# EAGLE design MinieasySens-RS485_V01-Build009 (EAGLE 7.6.0)
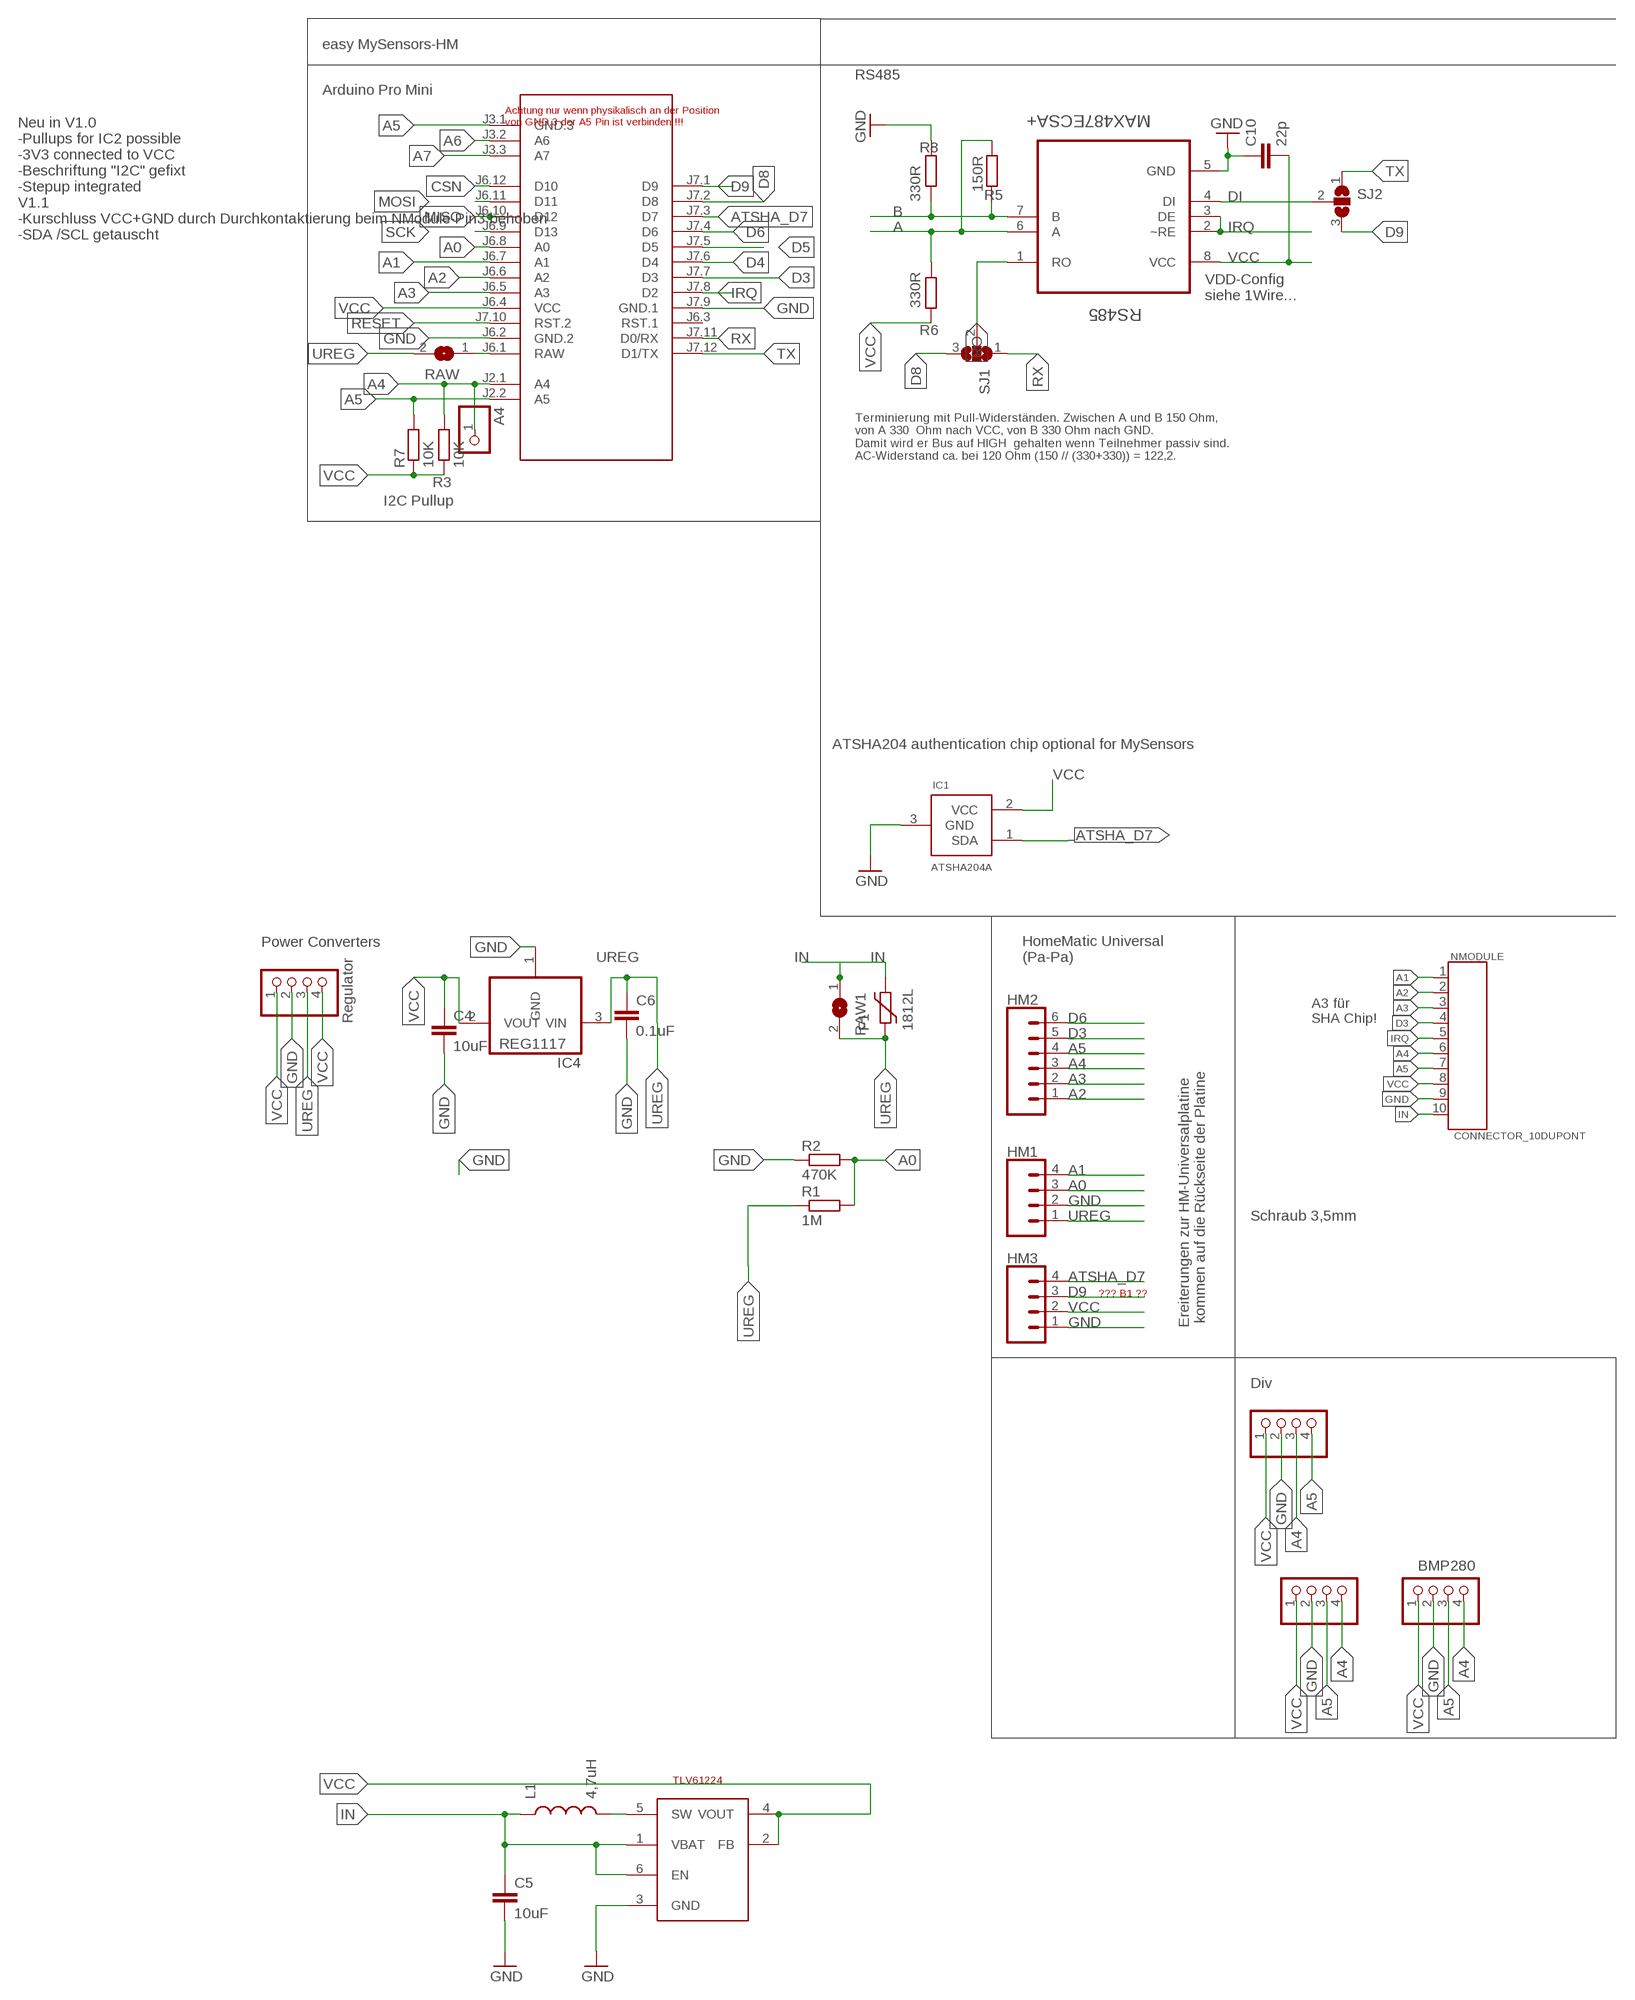
[diagram p0: schematic, sheet 1, part 1 of 2]
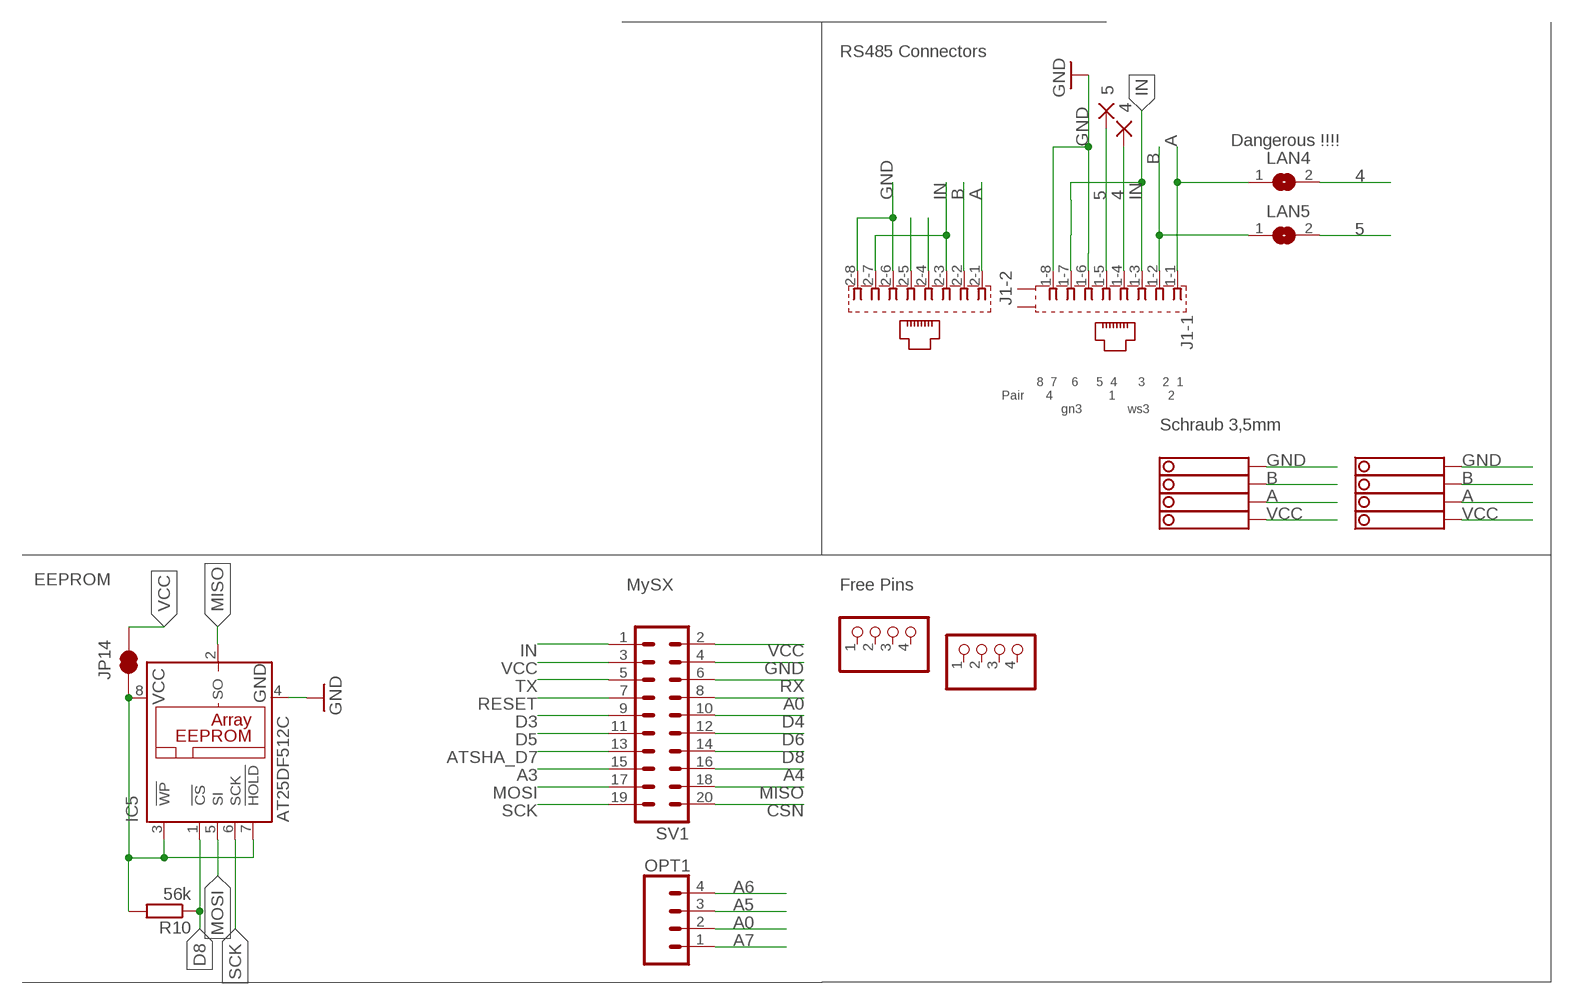
[diagram p1: schematic, sheet 1, part 2 of 2]

## Parts
4  1,6/0,8  [1,6/0,8]
5  1,6/0,8  [1,6/0,8]
A4  PINHD-1X1  [1X01]
BH1750  PINHD-1X04_2.54-S  [1X04-S]
C4  10uF  C-EUC1210  [C1210]
C5  10uF  CAP0805  [0805]
C6  0.1uF  C-EUC1206  [C1206]
C10  22p  C-EUC0805  [C0805]
F1  1812L  [1812L]
HM1  CONN_04  [1X04]
HM2  CONN_06SILK_FEMALE_PTH  [1X06]
HM3  CONN_04  [1X04]
I2C-1  PINHD-1X04_2.54-S  [1X04-S]
I2C-2  PINHD-1X04_2.54-S  [1X04-S]
IC1  ATSHA204A  [SOT23]
IC4  REG1117  [SOT223]
IC5  AT25DF512C  25AA080SN  [SO-08]
J1  557570-1  [557570-1]
JP2  PINHD-1X04_2.54-S  [1X04-S]
JP4  PINHD-1X04_2.54-S  [1X04-S]
JP14  JUMPER-SMT_2_NC_TRACE_SILK  [SMT-JUMPER_2_NC_TRACE_SILK]
L1  4,7uH  INDUCTOR0805  [0805]
LAN4  SJ  [SJ]
LAN5  SJ  [SJ]
M1  ARDUINO-PRO-MINI-3.3V#NP  [ARDUINO-PRO-MINI#NP]
NMODULE  CONNECTOR_10DUPONT  [DUPONT_10]
OPT1  CONN_04  [1X04]
R1  1M  R-EU_R0805  [R0805]
R2  470K  R-EU_R0805  [R0805]
R3  10K  R-EU_R0805  [R0805]
R5  150R  R-EU_R0805  [R0805]
R6  330R  R-EU_R0805  [R0805]
R7  10K  R-EU_R0805  [R0805]
R8  330R  R-EU_R0805  [R0805]
R10  56k  R-EU_M0805  [M0805]
RAW  SJ  [SJ]
RAW1  SJ  [SJ]
RS485  MAX487ECSA+  [SOIC127P600X175-8N]
SJ1  SJ2W  [SJ_2]
SJ2  SJ2W  [SJ_2]
STEPDWN  PINHD-1X04_2.54-S  [1X04-S]
STEPUP  TLV61224  TI-TLV61224  [SOT23-6L]
SV1  MA10-2  [MA10-2]
X1  1751264  [1751264]
X4  1751264  [1751264]

## Nets
4: 4.1(P) J1.1-4 LAN4.2
5: 5.1(P) J1.1-5 LAN5.2
A: J1.1-1 J1.2-1 LAN4.1 R5.1 R6.2 RS485.6(A) X1.2 X4.2
A0: HM1.3 M1.J6.8(A0) OPT1.2 R1.2 R2.2 SV1.8
A1: HM1.4 M1.J6.7(A1) NMODULE.1
A2: HM2.1 M1.J6.6(A2) NMODULE.2
A3: HM2.2 M1.J6.5(A3) NMODULE.3 SV1.15
A4: A4.1 BH1750.4 HM2.3 I2C-1.4 I2C-2.3 M1.J2.1(A4) NMODULE.6 R3.2 SV1.16
A5: BH1750.3 HM2.4 I2C-1.3 I2C-2.4 M1.J2.2(A5) M1.J3.1(GND.3) NMODULE.7 OPT1.3 R7.2
A6: M1.J3.2(A6) OPT1.4
A7: M1.J3.3(A7) OPT1.1
ATSHA_D7: HM3.4 IC1.1(SDA) M1.J7.3(D7) SV1.13
B: J1.1-2 J1.2-2 LAN5.1 R5.2 R8.1 RS485.7(B) X1.3 X4.3
CSN: M1.J6.12(D10) SV1.20
D3: HM2.5 M1.J7.7(D3) NMODULE.4 SV1.9
D4: M1.J7.6(D4) SV1.10
D5: M1.J7.5(D5) SV1.11
D6: HM2.6 M1.J7.4(D6) SV1.12
D8: IC5.1(!CS) M1.J7.2(D8) R10.1 SJ1.3 SV1.14
D9: HM3.3 M1.J7.1(D9) SJ2.3
DI: RS485.4(DI) SJ2.2
GND [Power]: BH1750.2 C4.2 C5.2 C6.2 C10.1 HM1.2 HM3.1 I2C-1.2 I2C-2.2 IC1.3(GND) IC4.1(GND) IC5.4(GND) J1.1-6 J1.1-8 J1.2-6 J1.2-8 M1.J6.2(GND.2) M1.J7.9(GND.1) NMODULE.9 R2.1 R8.2 RS485.5(GND) STEPDWN.2 STEPUP.3(GND) SV1.4 X1.4 X4.4
IN [Power]: C5.1 F1.P$2 J1.1-3 J1.1-7 J1.2-3 J1.2-7 L1.1 NMODULE.10 RAW1.1 STEPUP.1(VBAT) STEPUP.6(EN) SV1.1
IRQ: M1.J7.8(D2) NMODULE.5 RS485.2(~RE) RS485.3(DE)
MISO: IC5.2(SO) M1.J6.10(D12) SV1.18
MOSI: IC5.5(SI) M1.J6.11(D11) SV1.17
N$5: J1.2-4
N$6: J1.2-5
N$13: L1.2 STEPUP.5(SW)
RAW [Power]: M1.J6.1(RAW) RAW.1
RESET: M1.J7.10(RST.2) SV1.7
RO: RS485.1(RO) SJ1.2
RX: M1.J7.11(D0/RX) SJ1.1 SV1.6
SCK: IC5.6(SCK) M1.J6.9(D13) SV1.19
TX: M1.J7.12(D1/TX) SJ2.1 SV1.5
UREG [Power]: C6.1 F1.P$1 HM1.1 IC4.3(VIN) R1.1 RAW1.2 RAW.2 STEPDWN.3
VCC [Power]: BH1750.1 C4.1 C10.2 HM3.2 I2C-1.1 I2C-2.1 IC1.2(VCC) IC4.2(VOUT) JP14.2 M1.J6.4(VCC) NMODULE.8 R3.1 R6.1 R7.1 RS485.8(VCC) STEPDWN.1 STEPDWN.4 STEPUP.2(FB) STEPUP.4(VOUT) SV1.2 SV1.3 X1.1 X4.1
VCC1 [Power]: IC5.3(!WP) IC5.7(!HOLD) IC5.8(VCC) JP14.1 R10.2
Unconnected: J1.G1(-1:S2) J1.G3(-1:S1) JP2.1 JP2.2 JP2.3 JP2.4 JP4.1 JP4.2 JP4.3 JP4.4 M1.J6.3(RST.1)

## Notes on the sheet
- easy MySensors-HM
- RS485
- Arduino Pro Mini
- Achtung nur wenn physikalisch an der Position 
  von GND.3 der A5 Pin ist verbinden !!!
- Neu in V1.0
  -Pullups for IC2 possible
  -3V3 connected to VCC
  -Beschriftung "I2C" gefixt
  -Stepup integrated
  V1.1
  -Kurschluss VCC+GND durch Durchkontaktierung beim NModule-Pin3 behoben
  -SDA /SCL getauscht
- VDD-Config
  siehe 1Wire...
- Terminierung mit Pull-Widerständen. Zwischen A und B 150 Ohm,
  von A 330  Ohm nach VCC, von B 330 Ohm nach GND. 
  Damit wird er Bus auf HIGH  gehalten wenn Teilnehmer passiv sind.
  AC-Widerstand ca. bei 120 Ohm (150 // (330+330)) = 122,2.
- I2C Pullup
- RS485 Connectors
- Dangerous !!!!
- ATSHA204 authentication chip optional for MySensors
- Power Converters
- 8  7    6     5  4      3     2  1
  Pair      4                1               2
                   gn3             ws3
- HomeMatic Universal
  (Pa-Pa)
- Schraub 3,5mm
- Regulator
- A3 für 
  SHA Chip!
- EEPROM
- MySX | Free Pins
- Schraub 3,5mm
- ??? B1 ??
- Ereiterungen zur HM-Universalplatine
   kommen auf die Rückseite der Platine
- Div
- BMP280

## Library data of the parts
4 5 = wirepad:1,6/0,8: THROUGH-HOLE PAD
A4 = pinhead:PINHD-1X1: PIN HEADER
BH1750 I2C-1 I2C-2 JP2 JP4 STEPDWN = pinhead-2:PINHD-1X04: PIN HEADER
C4 C6 C10 = rcl:C-EU: CAPACITOR, European symbol
C5 = SparkFun-Passives:CAP: Capacitor Standard 0603 ceramic capacitor, and 0.1" leaded capacitor.
F1 = ptc-littlefuse:1812L
HM1 HM3 OPT1 = SparkFun-Connectors:CONN_04: Multi connection point. Often used as Generic Header-pin footprint for 0.1 inch spaced/style header connections On any of the 0.1 inch spaced packages, you can populate with these: Break Away Headers - Straight <https://www.sparkfun.com/products/116> (PRT-00116) Break Away Male Headers - Right Angle <https://www.sparkfun.com/products/553> (PRT-00553) Female Headers <https://www.sparkfun.com/products/115> (PRT-00115) Break Away Headers - Machine Pin <https://www.sparkfun.com/products/117> (PRT-00117) Break Away Female Headers - Swiss Machine Pin <https://www.sparkfun.com/products/743> (PRT-00743) For SCREWTERMINALS and SPRING TERMINALS visit here: Screw Terimnals on SparkFun.com <https://www.sparkfun.com/search/results?term=Screw+Terminals> (5mm/3.5mm/2.54mm spacing) This device is also useful as a general connection point to wire up your design to another part of your project. Our various solder wires solder well into these plated through hole pads. Hook-Up Wire - Assortment (Stranded, 22 AWG) <https://www.sparkfun.com/products/11375> (PRT-11375) Hook-Up Wire - Assortment (Solid Core, 22 AWG) <https://www.sparkfun.com/products/11367> (PRT-11367) View the entire wire category on our website here <https://www.sparkfun.com/categories/141> Special notes: Molex polarized connector foot print use with SKU : PRT-08231 with associated crimp pins and housings. 1MM SMD Version SKU: PRT-10208; PROD_ID: CONN-09696
HM2 = SparkFun-Connectors:CONN_06: Multi connection point. Often used as Generic Header-pin footprint for 0.1 inch spaced/style header connections On any of the 0.1 inch spaced packages, you can populate with these: Break Away Headers - Straight <https://www.sparkfun.com/products/116> (PRT-00116) Break Away Male Headers - Right Angle <https://www.sparkfun.com/products/553> (PRT-00553) Female Headers <https://www.sparkfun.com/products/115> (PRT-00115) Break Away Headers - Machine Pin <https://www.sparkfun.com/products/117> (PRT-00117) Break Away Female Headers - Swiss Machine Pin <https://www.sparkfun.com/products/743> (PRT-00743) Arduino Stackable Header - 6 Pin <https://www.sparkfun.com/products/9280> (PRT-09280) For SCREWTERMINALS and SPRING TERMINALS visit here: Screw Terimnals on SparkFun.com <https://www.sparkfun.com/search/results?term=Screw+Terminals> (5mm/3.5mm/2.54mm spacing) This device is also useful as a general connection point to wire up your design to another part of your project. Our various solder wires solder well into these plated through hole pads. Hook-Up Wire - Assortment (Stranded, 22 AWG) <https://www.sparkfun.com/products/11375> (PRT-11375) Hook-Up Wire - Assortment (Solid Core, 22 AWG) <https://www.sparkfun.com/products/11367> (PRT-11367) View the entire wire category on our website here <https://www.sparkfun.com/categories/141>; PROD_ID: CONN-08437
IC1 = Sensor:ATSHA204A
IC4 = burr-brown:REG1117: 800mA and 1A Low Dropout (LDO) Positive Regulator 1.8V, 2.5V, 2.85V, 3.3V, 5V, and Adj; MPN: REG1117; OC_FARNELL: 1097566; OC_NEWARK: 14P6981
IC5 = microchip:25*: Serial EEPROM 4K/ 8K , SPI bus; MF: MICROCHIP; MPN: 25AA080/SN; OC_FARNELL: 1816072; OC_NEWARK: 92C7351
J1 = con-amp:557570-1: AMP connector
JP14 = SparkFun-Jumpers:JUMPER-SMT_2_NC_TRACE: Normally closed trace jumper This jumper has a trace between two pads so it's normally closed (NC). Use a razor knife to open the connection. For best results follow the IPC guidelines for cutting traces: Cutout at least 0.063 mm (0.005 in). Remove all loose material to clean up the cut area. Seal the cut with an approved epoxy. Reapply solder to reclose the connection.
L1 = SparkFun-Passives:INDUCTOR: Inductors Basic Inductor/Choke - 0603 and 1206. Footprints are not proven and vary greatly between part numbers.
LAN4 LAN5 RAW RAW1 = jumper:SJ: SMD solder JUMPER
M1 = diy-modules:ARDUINO-PRO-MINI-*#NP: Arduino Pro Mini without programming pads
NMODULE = TD-MySensors:CONNECTOR_10
R1-R3 R5-R8 = rcl:R-EU_: RESISTOR, European symbol
R10 = resistor:R-EU_: RESISTOR, European symbol
RS485 = Maxim_By_element14_Batch_1:MAX487ECSA+: Low-Power, Slew-Rate-Limited RS-485/RS-422 Transceivers; MPN: MAX487ECSA+; OC_FARNELL: 9724532; OC_NEWARK: 68K4803; PACKAGE: SOIC-8; SUPPLIER: Maxim
SJ1 SJ2 = jumper:SJ2W: SMD solder JUMPER
STEPUP = TLV61224:TI-TLV61224
SV1 = con-lstb:MA10-2: PIN HEADER; OC_FARNELL: unknown; OC_NEWARK: unknown
X1 X4 = con-phoenix-350:1751264: MKDS 1/ 4-3,5 Printklemme Nennstrom: 10 A Bemessungsspannung: 160 V Raster: 3,5 mm Polzahl: 4 Montageart: Löten Anschlussart: Schraubanschluss Anschlussrichtung vom Leiter zur Platine: 0° Source: http://eshop.phoenixcontact.com .. 1751264.pdf; MPN: 1751264; OC_FARNELL: unknown; OC_NEWARK: 10R0934

## Net classes
0 default: width 0.305 mm
1 Power: width 0.508 mm

## Board
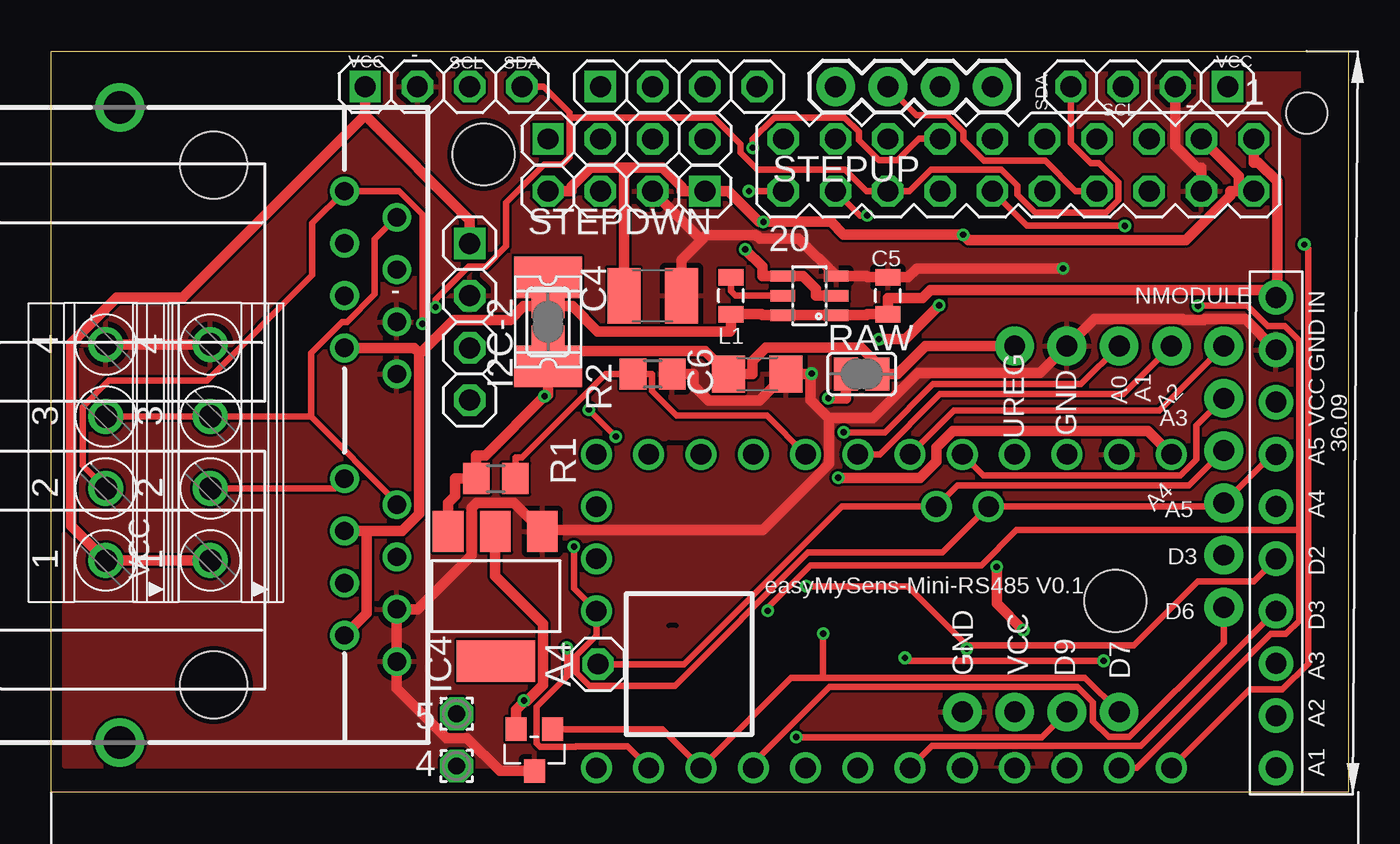
[diagram p2: board, top side]
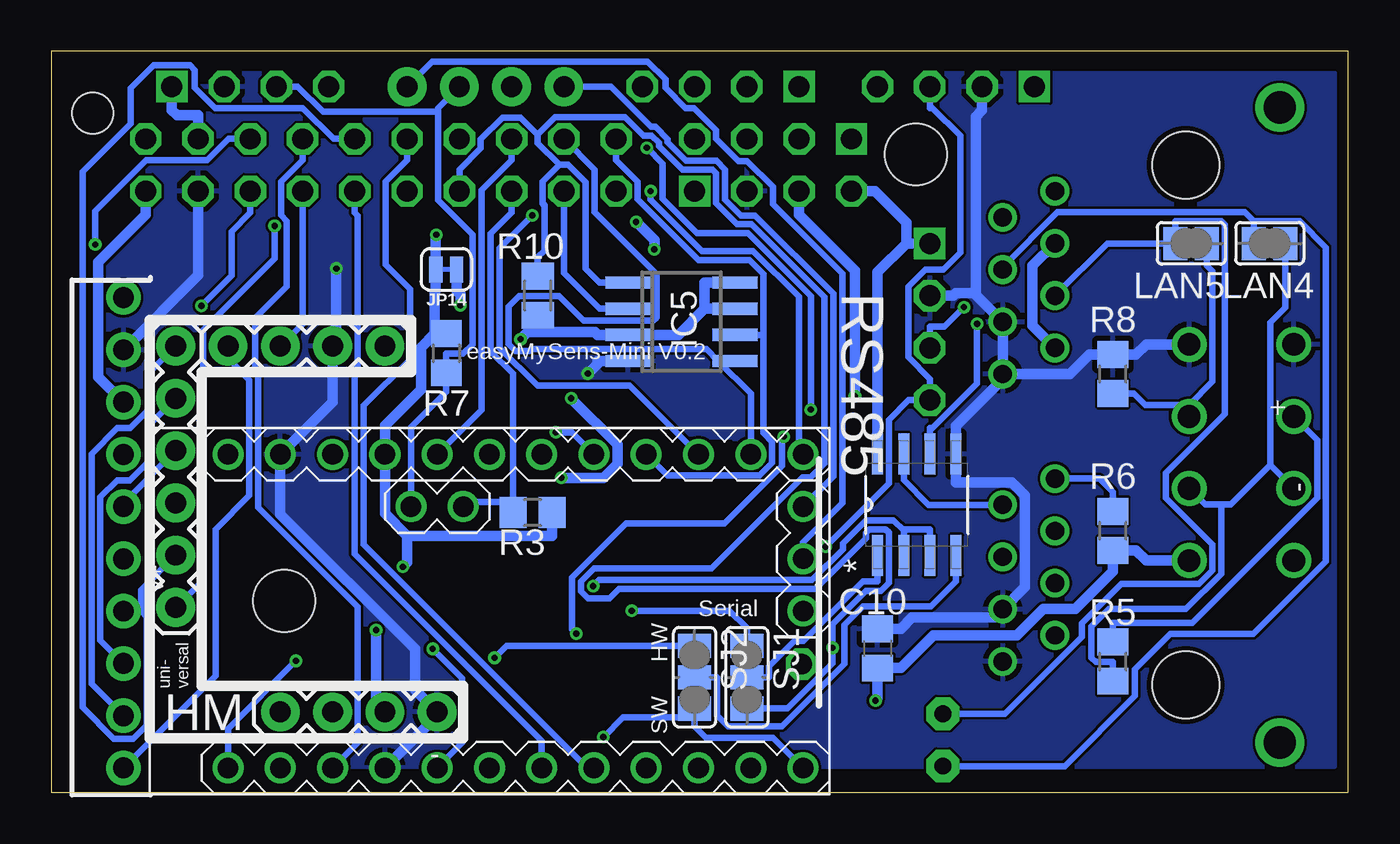
[diagram p3: board, bottom side, seen from below]

Size 63 x 36 mm. Coordinates in mm from the lower left corner, seen from the top.
Outline: 63,0 0,0 0,36 63,36 63,0
Copper layers (1*16): Top 0.035mm / dielectric 1.5mm / Bottom 0.035mm
Design rules "dirt_cheap_dirty_boards.v1": minimum track width 5mil, minimum drill 12mil, track to track 5mil, track to pad 5mil, pad to pad 5mil, via to via 5mil, smd to smd 0mil, copper to edge 10mil, drill to drill 10mil, minimum pad ring 10mil, minimum via ring 6mil, stop-mask expansion 2mil, vias tented up to drill 25mil, thermal gap 10mil
Holes 3 mm at 21,31 51.7,9.3
Holes 2 mm at 61,33
tRestrict: area 61,0 to 61,35.6; area 12.7,0 to 63.2,36.8; 2 lines
bRestrict: area 12.7,0 to 63,36.8; 2 lines

### Footprints (pad centres in the part's own frame; a part is rotated, then mirrored left to right if it is on the bottom)
1,6/0,8 = drill 0.813 pad 1.6 octagon: 1 0,0
1X01 = drill 1.016 octagon: 1 0,0
1X04-S = drill 1.016 square: 1 -3.81,0 | drill 1.016 octagon: 2 -1.27,0; 3 1.27,0; 4 3.81,0
C1210 = smd 1.6 x 2.7: 1 -1.4,0; 2 1.4,0
0805 = smd 0.8 x 1.2: 1 -0.9,0; 2 0.9,0
C1206 = smd 1.6 x 1.8: 1 -1.4,0; 2 1.4,0
C0805 = smd 1.3 x 1.5: 1 -0.95,0; 2 0.95,0
1812L = smd 2.03 x 3.3: P$1 -2.16,0; P$2 2.16,0
1X04 = drill 1.016 pad 1.88: 1 0,0; 2 2.54,0; 3 5.08,0; 4 7.62,0
1X06 = drill 1.016 pad 1.88: 1 0,0; 2 2.54,0; 3 5.08,0; 4 7.62,0; 5 10.16,0; 6 12.7,0
SOT23 = smd 1.016 x 1.143: 1 -0.889,-1.016; 2 0.889,-1.016; 3 0,1.016
SOT223 = smd 1.499 x 2.007: 1 -2.261,-3.15; 2 0.025,-3.15; 3 2.311,-3.15 | smd 3.81 x 2.007: 4 0,3.15
SO-08 = smd 0.6 x 2.2: 1 -1.905,-2.6; 2 -0.635,-2.6; 3 0.635,-2.6; 4 1.905,-2.6; 5 1.905,2.6; 6 0.635,2.6; 7 -0.635,2.6; 8 -1.905,2.6
557570-1 = drill 0.889: 1-1 -11.43,6.35; 1-2 -10.16,8.89; 1-3 -8.89,6.35; 1-4 -7.62,8.89; 1-5 -6.35,6.35; 1-6 -5.08,8.89; 1-7 -3.81,6.35; 1-8 -2.54,8.89; 2-1 2.54,6.35; 2-2 3.81,8.89; 2-3 5.08,6.35; 2-4 6.35,8.89; 2-5 7.62,6.35; 2-6 8.89,8.89; 2-7 10.16,6.35; 2-8 11.43,8.89 | drill 1.575 pad 2.184: G1 -15.494,-4.572; G3 15.367,-4.572 | hole 3.251: -12.7,0; 12.573,0
SMT-JUMPER_2_NC_TRACE_SILK = smd 0.635 x 1.27: 1 -0.508,0; 2 0.508,0
SJ = smd 1.168 x 1.6: 1 -0.762,0; 2 0.762,0
ARDUINO-PRO-MINI#NP = drill 1: J2.1 -1.27,5.08; J2.2 -3.81,5.08; J3.1 15.24,0; J3.2 15.24,2.54; J3.3 15.24,5.08; J6.1 -12.7,7.62; J6.2 -10.16,7.62; J6.3 -7.62,7.62; J6.4 -5.08,7.62; J6.5 -2.54,7.62; J6.6 0,7.62; J6.7 2.54,7.62; J6.8 5.08,7.62; J6.9 7.62,7.62; J6.10 10.16,7.62; J6.11 12.7,7.62; J6.12 15.24,7.62; J7.1 15.24,-7.62; J7.2 12.7,-7.62; J7.3 10.16,-7.62; J7.4 7.62,-7.62; J7.5 5.08,-7.62; J7.6 2.54,-7.62; J7.7 0,-7.62; J7.8 -2.54,-7.62; J7.9 -5.08,-7.62; J7.10 -7.62,-7.62; J7.11 -10.16,-7.62; J7.12 -12.7,-7.62
DUPONT_10 = drill 1.016 pad 1.676: 1 1.27,1.27; 2 3.81,1.27; 3 6.35,1.27; 4 8.89,1.27; 5 11.43,1.27; 6 13.97,1.27; 7 16.51,1.27; 8 19.05,1.27; 9 21.59,1.27; 10 24.13,1.27
R0805 = smd 1.3 x 1.5: 1 -0.95,0; 2 0.95,0
M0805 = smd 1.3 x 1.6: 1 -0.95,0; 2 0.95,0
SOIC127P600X175-8N = smd 1.981 x 0.533: 1 -2.464,1.905; 2 -2.464,0.635; 3 -2.464,-0.635; 4 -2.464,-1.905; 5 2.464,-1.905; 6 2.464,-0.635; 7 2.464,0.635; 8 2.464,1.905
SJ_2 = smd 1.168 x 1.6: 1 -1.524,0; 2 0,0; 3 1.524,0
SOT23-6L = smd 0.55 x 1.2: 1 -0.95,-1.3; 2 0,-1.3; 3 0.95,-1.3; 4 0.95,1.3; 5 0,1.3; 6 -0.95,1.3
MA10-2 = drill 1.016 octagon: 1 -11.43,-1.27; 2 -11.43,1.27; 3 -8.89,-1.27; 4 -8.89,1.27; 5 -6.35,-1.27; 6 -6.35,1.27; 7 -3.81,-1.27; 8 -3.81,1.27; 9 -1.27,-1.27; 10 -1.27,1.27; 11 1.27,-1.27; 12 1.27,1.27; 13 3.81,-1.27; 14 3.81,1.27; 15 6.35,-1.27; 16 6.35,1.27; 17 8.89,-1.27; 18 8.89,1.27; 19 11.43,-1.27; 20 11.43,1.27
1751264 = drill 1.1 pad 1.7: 1 -5.25,-0.1; 2 -1.75,-0.1; 3 1.75,-0.1; 4 5.25,-0.1

### Placement (x,y rotation side)
4  19.68,1.27 0 top
5  19.68,3.81 0 top
A4  26.56,6.22 90 top
BH1750  19.05,34.29 0 top
C4  29.21,24.13 0 top
C5  40.64,24.13 90 top
C6  34.29,20.32 0 top
C10  22.86,6.99 270 bottom
F1  24.13,22.86 90 top
HM1  46.8,21.68 180 bottom
HM2  56.96,21.68 270 bottom
HM3  44.26,3.9 180 bottom
I2C-1  53.34,34.29 180 top
I2C-2  20.32,22.86 270 top
IC1  23.46,2.04 180 top
IC4  21.59,9.53 180 top
IC5  32.38,22.86 270 bottom
J1  7.89,17.78 270 top
JP2  30.48,34.29 0 top
JP4  27.94,31.75 0 top
JP14  43.81,25.4 180 bottom
L1  33.02,24.13 90 top
LAN4  3.81,26.67 180 bottom
LAN5  7.62,26.67 180 bottom
M1  41.72,8.8 0 bottom
NMODULE  60.77,-0.09 90 top
OPT1  38.1,34.29 0 top
R1  21.59,15.24 0 top
R2  29.21,20.32 180 top
R3  39.62,13.59 180 bottom
R5  11.43,6.35 90 bottom
R6  11.43,12.7 90 bottom
R7  43.81,21.34 270 bottom
R8  11.43,20.32 90 bottom
R10  39.37,24.13 270 bottom
RAW  39.37,20.32 0 top
RAW1  24.13,22.86 270 top
RS485  20.95,13.97 90 bottom
SJ1  29.21,5.59 270 bottom
SJ2  31.75,5.59 270 bottom
STEPDWN  27.94,29.21 180 top
STEPUP  36.83,24.13 90 top
SV1  46.99,30.48 180 top
X1  2.54,16.51 90 top
X4  7.62,16.51 90 top

### Tracks (layer width: path | path; a pad name or v marks a point on that pad's centre or on a via)
4
  Bottom 0.305: 4.57,27.75 2.35,27.75 1.07,26.48 1.07,11.23 4.62,7.68 8.64,7.68 10.36,5.97 10.36,4.67 13.76,1.27 4.1 | 4.57,27.75 4.57,27.64 LAN4.2 | 4.57,27.75 5,28.18 14.12,28.18 16.78,25.52 J1.1-4
5
  Bottom 0.305: 5.1 16.67,3.81 12.93,7.55 12.93,8.21 11.01,10.13 7.25,10.13 6.59,10.79 6.59,12.03 8.85,14.29 8.85,15.53 5.99,18.38 5.99,27.59 6.15,27.75 8.38,27.75 LAN5.2 11.7,26.67 J1.1-5
A  (via drill 0.3 pad 0.61)
  Top 0.305: v18.03,22.77 18.03,28.08 16.89,29.21 J1.1-1 12.68,27.65 12.68,25.12 7.57,20.01 2.79,20.01 1.51,18.73 1.51,15.89 X1.2 | X4.2 13.76,14.76 J1.2-1
  Bottom 0.305: RS485.6 20.32,17.7 20.19,17.7 18.03,19.87 v18.03,22.77 | R6.2 11.43,14.58 12.09,15.24 J1.2-1 | 6.16,13.98 5.68,13.98 3.77,15.89 | X4.2 6.94,13.98 6.16,13.98 | 6.16,13.98 6.16,10.61 7.87,8.9 11.63,8.9 12.46,8.06 12.46,6.54 12.26,6.33 11.43,6.33 R5.1 | 3.77,15.89 3.77,22.83 3.05,23.55 LAN4.1 | X1.2 3.77,15.89
A0  (via drill 0.3 pad 0.61)
  Top 0.305: SV1.8 49.76,29.21 48.28,30.68 45.31,30.68 44.31,31.69 44.31,32.09 43.51,32.9 42.03,32.9 OPT1.2 | HM1.3 50.03,19.83 42.83,19.83 40.49,17.49 v38.49,17.49 | M1.J6.8 34.76,18.3 30.38,18.3 29.19,19.49 29.19,20.32 R2.2 27.33,20.32 26.91,20.32 22.86,16.27 22.54,16.27 R1.2
  Bottom 0.305: HM1.3 50.8,22.76 50.8,28.17 SV1.8 | M1.J6.8 37.71,17.49 v38.49,17.49
A1
  Top 0.305: HM1.4 52.08,19.34 43.18,19.34 40.26,16.42 M1.J6.7
  Bottom 0.305: NMODULE.1 55.02,5.66 55.02,12.77 53.39,14.41 53.39,20.04 54.42,21.07 HM1.4
A2
  Top 0.305: HM2.1 53.83,18.55 43.85,18.55 M1.J6.6
  Bottom 0.305: HM2.1 58.28,20.36 58.28,18.59 59.18,17.69 59.81,17.69 61.05,16.45 61.05,5.27 NMODULE.2
A3
  Top 0.305: M1.J6.5 45.29,15.39 54.85,15.39 55.63,16.16 55.63,17.81 HM2.2
  Bottom 0.305: HM2.2 58.22,17.88 58.22,16.12 59.19,15.15 59.81,15.15 60.62,14.34 60.62,7.38 NMODULE.3 | SV1.15 40.64,30.71 42.1,29.25 42.1,18.58 M1.J6.5
A4  (via drill 0.3 pad 0.61)
  Top 0.305: HM2.3 55.27,14.91 44.02,14.91 M1.J2.1 38.4,13.88 30.74,6.22 27.6,6.22 A4.1 | I2C-1.4 49.53,31.54 50.49,30.58 50.9,30.58 51.84,29.64 51.84,28.78 51.23,28.17 47.82,28.17 46.94,29.05 46.94,29.47 46.15,30.25 42.72,30.25 41.68,29.21 SV1.16 40.6,29.21 40.56,29.21 40.12,29.21 39.6,29.21 38.56,30.25 34.32,30.25 33.49,31.08 33.49,31.49 32.19,32.79 25.17,32.79 | 25.17,32.79 25.17,33.02 23.9,34.29 BH1750.4 | v18.66,23.57 18.66,23.95 20.27,25.55 21.12,25.55 22.1,26.53 22.1,28.65 23.95,30.5 24.8,30.5 25.17,30.87 25.17,32.79
  Bottom 0.305: HM2.3 59.5,14.06 NMODULE.6 | 40.57,14.1 42.77,14.1 M1.J2.1 | I2C-2.3 20.32,22.63 19.6,22.63 v18.66,23.57 | 40.57,14.1 40.57,14.62 40.57,20.34 41.66,21.42 41.66,27.15 40.64,28.17 SV1.16 | R3.2 40.57,14.1
A5  (via drill 0.3 pad 0.61)
  Top 0.305: v25.39,11.93 25.39,9.89 M1.J3.1 26.48,7.62 25.51,6.64 25.51,5.8 26.14,5.17 30.3,5.17 36.77,11.64 43.29,11.64 M1.J2.2 56.78,13.88 HM2.4 59.32,16.42 NMODULE.7
  Bottom 0.305: 44.22,33.07 44.22,28.78 42.55,27.1 42.55,21.76 42.99,21.32 43.81,21.32 R7.2 43.81,19.92 43.81,19.46 45.53,17.74 M1.J2.2 | OPT1.3 44.22,33.25 44.22,33.07 | 44.22,33.07 49.81,33.07 51.03,34.29 I2C-1.3 | v25.39,11.93 22.31,15 22.31,18.1 21.36,19.05 I2C-2.4 20.32,20.09 21.36,21.14 21.36,24.57 20.53,25.4 19.66,25.4 18.84,26.23 18.84,31.89 20.19,33.25 20.32,33.25 BH1750.3
A6
  Bottom 0.305: M1.J3.2 26.48,12.14 24.57,14.05 24.57,25.21 27.94,28.58 27.94,29.42 29.2,30.68 29.61,30.68 30.71,31.77 30.71,32.18 31.77,33.25 32.18,33.25 33.17,34.24 33.17,34.65 34.04,35.51 44.5,35.51 OPT1.4
A7
  Bottom 0.305: M1.J3.3 25.01,15.35 25.01,24.23 28.81,28.03 29.5,28.03 30.28,28.8 30.28,30.27 30.69,30.68 32.16,30.68 33.06,31.58 33.06,31.74 33.65,32.34 33.86,32.34 35.81,34.29 OPT1.1
ATSHA_D7  (via drill 0.3 pad 0.61)
  Top 0.305: v37.49,7.7 37.49,5.56 | 37.49,5.56 35.94,5.56 M1.J7.3 29.68,3.06 25.14,3.06 IC1.1 | HM3.4 50.22,5.56 37.49,5.56 | v26.1,18.6 v27.41,17.29 | SV1.13 42.14,31.75 41.1,30.71 40.2,30.71 39.23,31.68 39.23,32.1 38.54,32.79 35.13,32.79 34.07,31.74 v34.07,31.32
  Bottom 0.305: v27.41,17.29 27.51,17.19 27.51,15.85 30.3,13.06 35.08,13.06 37.71,10.43 37.71,7.92 v37.49,7.7 | v34.07,31.32 33.3,30.55 33.3,28.84 31.63,27.17 29.17,27.17 26.1,24.1 v26.1,18.6
B
  Top 0.305: 12.61,18.26 16.78,14.09 J1.2-2 | 12.61,18.26 X4.3 X1.3 | 12.61,18.26 12.61,21.34 14.13,22.86 14.36,22.86 15.71,24.21 15.71,26.87 J1.1-2
  Bottom 0.305: X1.3 1.51,17.13 1.51,14.29 7.57,8.23 11.43,8.23 R5.2 | 7.72,18.83 9.86,18.83 10.4,19.37 R8.1 | 7.72,18.83 6.59,19.96 6.59,25.32 6.86,25.59 LAN5.1 | X4.3 7.72,18.83 | RS485.7 21.59,15.16 20.4,13.97 J1.2-2
CSN  (via drill 0.3 pad 0.61)
  Top 0.305: SV1.20 v33.89,29.21
  Bottom 0.305: M1.J6.12 26.69,16.63 26.69,24.08 28.91,26.3 31.39,26.3 33.89,28.81 v33.89,29.21
D3
  Top 0.305: NMODULE.4 52.94,2.24 42.78,2.24 M1.J7.7
  Bottom 0.305: 58.65,8.8 58.38,8.53 58.38,3.26 59.03,2.6 59.97,2.6 61.49,4.12 61.49,30.16 59.16,32.48 59.16,34.2 58.03,35.33 56.27,35.33 56.03,35.09 56.03,34.24 55.04,33.25 50.8,33.25 49.3,31.75 SV1.9 | HM2.5 58.65,9.83 58.65,8.8 | NMODULE.4 58.65,8.8
D4
  Bottom 0.305: M1.J7.6 39.18,2.5 48.27,11.59 48.27,20.46 48.12,20.61 48.12,28.02 48.26,28.17 SV1.10
D5
  Bottom 0.305: SV1.11 45.72,30.71 46.76,29.67 46.76,25.63 45.58,24.45 45.58,21.04 47.83,18.78 47.83,12.03 36.98,1.18 M1.J7.5
D6  (via drill 0.3 pad 0.61)
  Top 0.305: SV1.12 47.41,27.52 v52.15,27.52 | HM2.6 56.96,7.25 52.39,2.68 51.37,2.68 50.61,3.44 50.61,4.36 49.84,5.12 37.8,5.12 34.1,1.42 M1.J7.4
  Bottom 0.305: v52.15,27.52 52.15,25.93 55.64,22.45 55.64,10.3 | 55.64,10.3 | 55.64,10.3 HM2.6
D8  (via drill 0.3 pad 0.61)
  Top 0.305: v25.05,7.01 25.05,5.62 23.57,4.14 23.57,2.37 23.73,2.21 25.47,2.21 25.48,2.22 27.98,2.22 M1.J7.2
  Bottom 0.305: 39.37,31.96 38.53,32.8 35.13,32.8 34.24,31.9 33.83,31.9 33.49,31.56 33.49,31.4 32.34,30.25 30.87,30.25 30.71,30.09 30.71,28.62 29.69,27.6 28.99,27.6 25.45,24.05 25.45,15.98 26.13,15.3 26.52,15.3 30.94,10.88 36.64,10.88 37.27,10.25 37.27,9.77 36.93,9.43 35.88,9.43 35.43,9.87 25.87,9.87 23.42,12.32 23.42,12.6 23.24,12.78 22.48,12.78 22.31,12.61 22.31,10.17 22.7,9.78 23.43,9.78 25.05,8.16 v25.05,7.01 25.05,6.26 27.24,4.06 SJ1.3 | 38.32,30.49 37.91,30.49 37.06,29.64 37.06,25.46 36.36,24.77 IC5.1 | 39.37,31.96 39.37,31.54 38.32,30.49 | 38.32,30.49 39.15,29.67 39.15,28.62 39.05,28.52 39.05,26.33 39.37,26.01 R10.1 | 39.37,31.96 40.2,32.79 41.07,32.79 42.14,31.73 42.14,31.29 43.18,30.25 SV1.14
D9  (via drill 0.3 pad 0.61)
  Top 0.305: v36.18,2.68 48.12,2.68 HM3.3
  Bottom 0.305: 31.75,3.63 35.23,3.63 v36.18,2.68 | 31.75,3.63 31.75,3.2 31.19,2.64 27.94,2.64 M1.J7.1 | SJ2.3 31.75,3.63
DI
  Bottom 0.305: RS485.4 19.05,10.24 20.27,9.02 23.57,9.02 24.46,8.13 24.46,6.23 27.49,3.2 30.13,3.2 30.67,3.74 30.67,5.59 SJ2.2
GND  (via drill 0.3 pad 0.61)
  Top 0.508: NMODULE.9 58,23 56.04,23 55.99,22.95 55.02,22.95 54.97,23 50.66,23 HM1.2 48.02,20.36 42.1,20.36 39.92,18.19 37.85,18.19 37.79,18.13 | SV1.4 55.88,30.35 55.66,30.35 54.61,31.4 I2C-1.2 | v49.16,25.45 42.04,25.45 41.62,25.03 C5.2 39.66,25.03 39.61,25.08 STEPUP.3 36.3,26.91 34.43,26.91 34.31,27.03 34.25,27.03 34.22,27.07 31.82,27.07 31.58,26.84 | R2.1 31.19,20.32 31.19,19.77 31.92,19.04 34.41,19.04 C6.2 36.87,20.32 | 37.79,18.13 37.79,18.12 37.79,18.07 37.78,18.06 37.78,15.95 34.57,12.74 23.92,12.74 IC4.1 | 37.79,18.13 36.87,19.05 36.87,20.32 | v36.93,20.35 36.9,20.35 36.87,20.32 | IC4.1 | IC4.1 22.48,14.06 20.66,14.06 20.41,13.81 20.41,11.51 17.79,8.89 J1.2-6 J1.2-8 16.78,5.04 19.2,2.63 20.2,2.63 21.8,1.03 IC1.3 | 31.58,26.84 30.61,25.86 C4.2 | STEPDWN.2 31.58,26.84 | X4.4 X1.4
  Bottom 0.508: v49.16,25.45 49.16,21.86 HM1.2 49.34,18.96 M1.J6.2 51.88,13.51 45.34,6.97 45.34,4.98 HM3.1 44.26,3.72 M1.J7.9 | IC5.4 36.47,20.95 36.47,20.82 v36.93,20.35 | C10.1 21.73,7.93 21.18,8.48 17.18,8.48 J1.2-6 15.7,9.97 15.7,14.42 16.34,15.06 19.05,15.06 RS485.5 19.05,17.8 16.78,20.07 J1.1-8 | 18.09,24.26 18.09,32.84 17.78,33.15 BH1750.2 | 18.09,24.26 18.09,24.17 J1.1-6 J1.1-8 | 18.09,24.26 19.05,24.26 19.18,24.13 I2C-2.2 | X4.4 9.81,21.76 10.3,21.27 R8.2 12.56,21.27 13.51,20.32 J1.1-8 | SV1.4 55.88,25.12 NMODULE.9
  pour Bottom: 0.64,34.92 60.96,34.92 60.96,1.27 0.64,1.27
  pour Top: 0.64,34.92 60.96,34.92 60.96,1.27 0.64,1.27
IN
  Top 0.508: 17.86,21.36 17.95,21.36 19.55,22.95 22.28,22.95 22.95,23.62 RAW1.1 | J1.1-7 17.63,21.59 17.86,21.36 | 17.86,21.36 17.86,13.53 17.04,12.7 15.32,12.7 | 59.15,24.39 59.56,24.81 59.56,29.69 58.64,30.61 58.42,30.61 SV1.1 | 59.15,24.39 42.7,24.39 42.32,24.01 40.64,24.01 C5.1 39.66,23.23 39.61,23.18 STEPUP.1 STEPUP.6 34.55,23.18 34.5,23.23 33.51,23.23 33.27,23.23 L1.1 33.02,22.45 32.97,22.4 26.54,22.4 25.31,23.62 RAW1.1 | NMODULE.10 59.15,24.39 | RAW1.1 F1.P$2 | 15.32,12.7 J1.2-3 | 15.32,12.7 15.32,8.7 J1.2-7
  Bottom 0.508: J1.1-7 15.33,22.68 15.33,25.58 J1.1-3
IRQ  (via drill 0.3 pad 0.61)
  Top 0.305: 44.48,7.14 v44.48,6.97 | v36.68,10.01 41.61,10.01 44.48,7.14 | NMODULE.5 58.41,10.25 55.71,10.25 52.6,7.14 44.48,7.14
  Bottom 0.305: M1.J7.8 43.04,2.4 43.04,5.53 v44.48,6.97 | 21.59,12.72 22.08,13.21 23.42,13.21 24.55,12.09 24.55,11.8 26.05,10.31 36.39,10.31 v36.68,10.01 | 21.59,12.72 21.54,12.78 20.32,12.78 RS485.3 | 21.59,12.72 21.59,12.67 RS485.2
MISO  (via drill 0.3 pad 0.61)
  Top 0.305: SV1.18 39.28,28.03 v39.64,28.03
  Bottom 0.305: v39.64,28.03 41.22,26.45 41.22,21.6 39.39,19.76 34.9,19.76 M1.J6.10 | IC5.2 35.57,23.5 36.36,23.5 38.1,25.23 38.1,28.17 SV1.18
MOSI
  Bottom 0.305: 30.6,20.95 31.18,21.53 39.69,21.53 39.79,21.43 40.45,21.43 40.79,21.78 40.79,23.61 40.29,24.11 38.34,24.11 37.15,22.92 33.77,22.92 33.61,23.08 33.61,25.18 36.6,28.18 36.6,30.25 SV1.17 | M1.J6.11 29.02,19.37 30.6,20.95 | IC5.5 30.6,20.95
N$13
  Top 0.305: L1.2 33.02,24.35 33.24,24.13 STEPUP.5
RAW  (via drill 0.3 pad 0.61)
  Top 0.508: v37.75,19.14 38.61,19.14 RAW.1 | M1.J6.1 53.28,17.56 43.79,17.56 42.99,16.76 42.99,16.08 42.19,15.28 v38.23,15.28
  Bottom 0.508: v38.23,15.28 36.17,15.28 35.5,15.95 35.5,16.89 v37.75,19.14
RESET
  Bottom 0.305: M1.J7.10 48.12,2.4 48.12,8.99 52.95,13.83 52.95,20.46 53.1,20.61 53.1,23.05 51.57,24.58 51.57,27.77 51.84,28.04 51.84,29.67 50.8,30.71 SV1.7
RO
  Bottom 0.305: RS485.1 22.86,10.24 23.58,10.24 26.45,7.36 26.89,7.36 28.13,6.12 28.13,5.59 SJ1.2
RX  (via drill 0.3 pad 0.61)
  Top 0.305: 60.62,12.74 46.89,12.74 45.18,11.03 36.88,11.03 34.8,8.96 v34.8,8.81 | v55.71,23.64 58.11,23.64 59.1,22.65 59.93,22.65 60.62,21.96 60.62,12.74 | 60.62,12.74 60.62,8.34 59.97,7.68 59.25,7.68 52.75,1.18 M1.J7.11
  Bottom 0.305: v34.8,8.81 30.05,8.81 29.21,7.98 SJ1.1 | v55.71,23.64 54.26,25.1 54.26,27.25 | 54.26,27.25 | 54.26,27.25 53.34,28.17 SV1.6
SCK
  Bottom 0.305: M1.J6.9 33.07,15.39 28.59,15.39 27.98,15.99 27.98,17.03 28.41,17.45 28.41,22.23 | 28.41,22.23 28.41,25.18 29.09,25.87 31.57,25.87 34.52,28.82 34.52,29.66 35.56,30.71 SV1.19 | IC5.6 28.41,22.23
TX  (via drill 0.3 pad 0.61)
  Top 0.305: M1.J7.12 58.23,4.99 59.82,4.99 61.06,6.23 61.06,26.43 v60.87,26.62 | v41.47,6.53 41.62,6.38 v51.12,6.38
  Bottom 0.305: v60.87,26.62 60.87,28.24 58.4,30.71 55.42,30.71 54.38,31.75 SV1.5 | M1.J7.12 54.42,3.08 v51.12,6.38 | SJ2.1 40.88,7.11 v41.47,6.53
UREG  (via drill 0.3 pad 0.61)
  Top 0.508: 40.62,20.32 39.33,21.6 34.73,21.6 34.07,20.95 34.07,20.32 C6.1 31.76,21.45 24.13,21.45 | 40.62,20.32 41.1,20.32 42.46,21.68 HM1.1 | RAW.2 40.62,20.32 | 24.13,21.45 RAW1.2 | 24.13,21.45 F1.P$1 24.13,19.3 24.02,19.3 v23.96,19.25 21.08,16.37 20.64,16.37 R1.1 19.61,15.24 19.61,14.39 19.28,14.06 IC4.3
  Bottom 0.508: STEPDWN.3 26.67,28.07 23.96,25.36 v23.96,19.25
VCC  (via drill 0.3 pad 0.61)
  Top 0.508: 57.68,29.21 57.28,29.21 57.28,28.99 55.12,26.84 44.55,26.84 v44.3,27.09 38.49,27.09 37.87,27.72 v34.59,27.72 34.38,27.72 32.89,29.21 STEPDWN.1 30.61,29.21 30.61,29.43 29.68,30.36 27.82,30.36 | SV1.2 57.68,29.21 | SV1.3 57.68,29.95 57.68,29.21 | v45.93,10.95 45.93,9.17 v47.22,7.88 | 15.24,32.89 6.38,24.03 3.17,24.03 0.97,21.84 0.97,12.93 X1.1 X4.1 | 27.82,30.36 26.2,30.36 25.27,29.43 25.27,29.21 STEPDWN.4 | 27.82,30.36 27.82,25.87 27.81,25.86 C4.1 | v33.71,26.38 34.55,25.54 34.55,25.08 STEPUP.4 36.51,25.08 37.15,24.44 37.15,24.13 STEPUP.2 | IC4.2 21.57,10.5 23.88,8.19 23.88,5.21 23.11,4.45 v22.96,4.45 22.96,4.4 22.58,4.01 IC1.2 | 15.24,32.89 BH1750.1 | 15.24,32.89 20.32,27.81 I2C-2.1
  Bottom 0.508: SV1.2 58.42,28.07 60.72,25.76 60.72,20.18 NMODULE.8 | v44.3,27.09 44.32,27.07 44.32,26.42 JP14.2 44.32,24.38 44.38,24.33 44.38,22.29 | 45.72,12.46 46.8,13.54 M1.J6.4 46.8,17.83 45.05,19.58 45.05,21.62 44.38,22.29 | 45.72,12.46 38.67,12.46 R3.1 | 45.72,12.46 45.72,11.16 v45.93,10.95 | v47.22,7.88 47.22,4.32 HM3.2 | v33.71,26.38 33.71,26.83 v34.59,27.72 | RS485.8 22.86,25.27 21.46,26.67 | I2C-2.1 21.46,26.67 | STEPDWN.4 22.99,29.21 21.46,27.69 21.46,26.67 | SV1.3 55.88,32.89 56.9,32.89 57.15,33.15 I2C-1.1 | X4.1 9.81,11.26 10.3,11.75 R6.1 11.43,10.72 13.24,8.91 14.79,8.91 16.09,7.61 20.15,7.61 21.73,6.04 C10.2 22.86,4.55 v22.96,4.45 | R7.1 44.38,22.29
VCC1  (via drill 0.3 pad 0.61)
  Top 0.508: v40.21,22.02 41.49,22.02 v43.13,23.66
  Bottom 0.508: 39.14,22.36 36.6,22.36 36.47,22.23 IC5.3 32.54,22.23 31.27,23.5 | v40.21,22.02 39.87,22.36 39.14,22.36 | 39.14,22.36 39.14,23.18 R10.2 | IC5.7 31.27,23.5 | IC5.8 31.27,24.77 31.27,23.5 | JP14.1 43.31,24.38 43.13,24.21 v43.13,23.66

### Text on the board
tPlace: easyMySens-Mini-RS485 V0.1
bPlace: easyMySens-Mini V0.2 | HM | uni- / versal
tNames: SCL | SDA | VCC | - | SDA | VCC | - | SCL | - | - | IN | UREG | GND | A0 | A1 | GND | A3 | A2 | VCC | A5 | A4 | A5 | A4 | D3 | D2 | VCC | D6 | D3 | GND | VCC | D9 | D7 | A3 | A2 | A1
bNames: + | - | V+ | Serial | HW | SW | -